# Altium project Multi-Channel Design 1 - Brendan Cook.PrjPCB
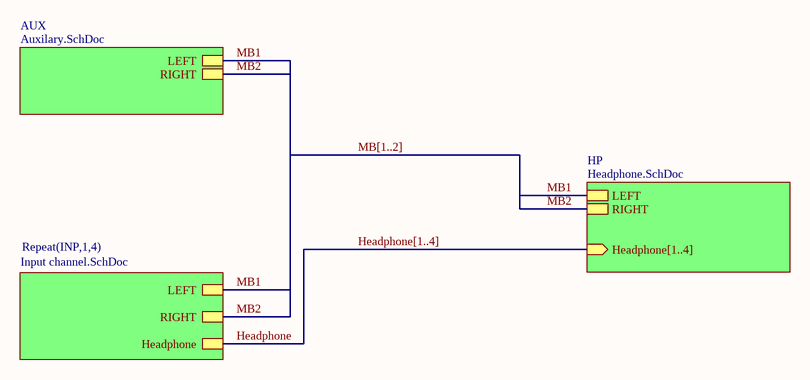
[diagram p0: Mixer.SchDoc]
SCH_REV: A; SCH_ENGINEER_APP_DATE: --/--/----; SCH_ENGINEER: - -----; SCH_DESIGNER_APP_DATE: --/--/----; SCH_DESIGNER: - -----; SCH_CHECKER_APP_DATE: --/--/----; SCH_CHECKER: - -----; Project_Name: ABC123; PCB_TITLE_2: <TITLE 2>; PCB_TITLE_1: <TITLE 1>; PCB_SCALE: NONE; PCB_REV: 1.0; PCB_PART_NUMBER: <PCB PN>; PCB_ENGINEER_APP_DATE: --/--/----; PCB_ENGINEER: - -----; PCB_DWG_NO: A-ET-A365-001; PCB_DESIGNER_APP_DATE: --/--/----; PCB_DESIGNER: - -----; PCB_CHECKER_APP_DATE: --/--/----; PCB_CHECKER: - -----; PCB_ASSEMBLY_NO: <PCB ASSY NO>; PCB_ANG_TOL: +/-1/2; PCB_3_DEC_TOL: +/-.010; PCB_2_DEC_TOL: +/-.01; DRAFTSMAN_FABRICATION_SCALE: 1:1; DRAFTSMAN_ASSEMBLY_SCALE: 1:1; DOC_NO_SCH_DWG: <SCH DWG NO>; DOC_NO_FAB_DWG: <FAB DWG NO>; DOC_NO_BOM: <BOM DOC NO>; DOC_NO_ASSY_DWG: <ASSY DWG NO>; CONTRACT_NUMBER: <CONTRACT NO>; CAGE_CODE: -----; Altium Training Module: Module [--] / [Title]; Altium Training: Altium Designer Advanced Training Course - A365; Altium Department: Altium Training Department
4 sheets, 97 parts. Net scope: hierarchical (ports join the sheet entries above them; power ports are global).
Board file: Mixer.PCBDOC
Sheets:
  Mixer.SchDoc
    AUX = Auxilary.SchDoc
    HP = Headphone.SchDoc
    INP1 = Input channel.SchDoc
    INP2 = Input channel.SchDoc
    INP3 = Input channel.SchDoc
    INP4 = Input channel.SchDoc

## Sheet Mixer.SchDoc
size 431 x 279 mm; Organization: ORGANIZATION; Address1: ADDRESS 1; Address2: ADDRESS 2; Address3: ADDRESS 3; Address4: ADDRESS 4; Revision: -; ENG_APP_DATE: --/--/--; DSN_APP_DATE: --/--/--; CHK_APP_DATE: --/--/--

### Sub-sheets
AUX = Auxilary.SchDoc: LEFT, RIGHT
HP = Headphone.SchDoc: Headphone[1..4] (in), LEFT, RIGHT
Repeat(INP,1,4) = Input channel.SchDoc: LEFT, RIGHT, Headphone

### Nets
MB1: sheet AUX/LEFT, sheet HP/LEFT, sheet Repeat(INP,1,4)/LEFT  [project net LCHANNEL]
MB2: sheet AUX/RIGHT, sheet HP/RIGHT, sheet Repeat(INP,1,4)/RIGHT

### Buses and harness runs
bus Headphone[1..4] = sheet HP/Headphone[1..4]
bus MB[1..2]

### Notes on the sheet
- DWG. NO.
- REV.
- SHT.
- THIS DOCUMENT AND THE DATA DISCLOSED HEREIN OR HEREWITH IS THE PROPERTY OF ALTIUM LIMITED AND MAY BE FREELY DISTRIBUTED IN WHOLE. NO RIGHTS ARE RESERVED OR EXPRESS OR IMPLIED WARANTEE GIVEN.
- REVISION
- DESCRIPTION
- DATE
- APPROVED
- ENG:
- DSN:
- APPROVALS
- PROJECT REVISION:
- www.altium.com <http://www.altium.com>
- DOCUMENT REVISION:
- 92037, La Jolla
- USA
- Altium Ltd.
- 4225 Executive Square
- CHK:
- REFERENCE DOCUMENTS
- DESIGN ITEM:
- TITLE
- VARIANT
- BOM:
- FAB DWG:
- PCB DWG:
- ASSY DWG:
- SCALE:
- SIZE
- B
- CAGE CODE
- FILE NAME
- DWG NO.
- SHEET
- OF
- REV

## Sheet Auxilary.SchDoc: Multi-Channel Design
size 431 x 279 mm; Organization: Altium Limited; Address1: L3, 12a Rodborough Rd; Address2: Frenchs Forest; Address3: NSW; Address4: Australia 2086; DocumentNumber: 1; SheetNumber: 1; SheetTotal: 8
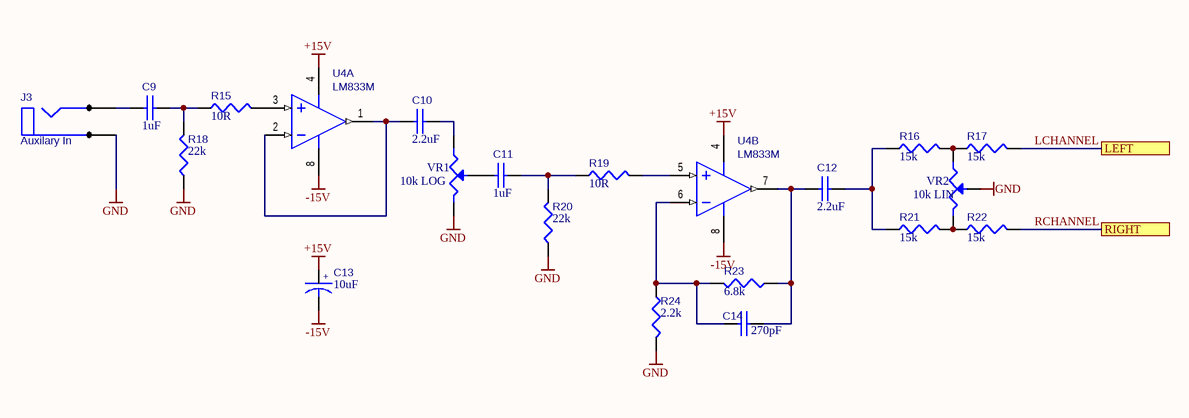
[diagram p1: Auxilary.SchDoc]

### Parts
C9  1uF  [RB.2/.4-NP]
C10  2.2uF  [RB.2/.4-NP]
C11  1uF  [RB.2/.4-NP]
C12  2.2uF  [RB.2/.4-NP]
C13  10uF  [RB.2/.4]
C14  270pF  [RAD0.2]
J3  Auxilary In  [JACK-6.25MM]
R15  10R  [AXIAL0.4]
R16  15k  [AXIAL0.4]
R17  15k  [AXIAL0.4]
R18  22k  [AXIAL0.4]
R19  10R  [AXIAL0.4]
R20  22k  [AXIAL0.4]
R21  15k  [AXIAL0.4]
R22  15k  [AXIAL0.4]
R23  6.8k  [AXIAL0.4]
R24  2.2k  [AXIAL0.4]
U4  LM833M  [DIP8]  (parts A,B of 2)
VR1  10k LOG  [POT - 24MM]
VR2  10k LIN  [POT - 24MM]

### Ports
LEFT, RIGHT

### Nets
+15V: C13.1 U4.4(V-)
-15V: C13.2 U4.8(V+)
GND: J3.3(C) R18.1 R20.1 R24.2 VR1.3 VR2.2(W)
LCHANNEL: R17.2 ; port LEFT
RCHANNEL: R22.2 ; port RIGHT  [project net MB2]
NetC9_1: C9.1 J3.1(A)
NetC9_2: C9.2 R15.1 R18.2
NetC10_1: C10.1 U4.1(OUT1) U4.2(IN1-)
NetC10_2: C10.2 VR1.1
NetC11_1: C11.1 VR1.2(W)
NetC11_2: C11.2 R19.1 R20.2
NetC12_1: C12.1 C14.2 R23.1 U4.7(OUT2)
NetC12_2: C12.2 R16.1 R21.1
NetC14_1: C14.1 R23.2 R24.1 U4.6(IN2-)
NetR15_2: R15.2 U4.3(IN1+)
NetR16_2: R16.2 R17.1 VR2.1
NetR19_2: R19.2 U4.5(IN2+)
NetR21_2: R21.2 R22.1 VR2.3

### Notes on the sheet
- 8
- 7
- 6
- 5
- 4
- 3
- DWG. NO.
- REV.
- SHT.
- 2
- 1
- THIS DOCUMENT AND THE DATA DISCLOSED HEREIN OR HEREWITH IS THE PROPERTY OF ALTIUM LIMITED AND MAY BE FREELY DISTRIBUTED IN WHOLE. NO RIGHTS ARE RESERVED OR EXPRESS OR IMPLIED WARANTEE GIVEN.
- REVISION
- DESCRIPTION
- DATE
- APPROVED
- F
- E
- D
- C
- B
- A
- TITLE
- SCALE:
- SIZE
- CAGE CODE
- FILE NAME
- DWG NO.
- SHEET
- OF
- REV
- (in symbol CAPACITOR POL) +

### Library data of the parts
C9-C12 C14 = CAP: Capacitor
  C14: Value: 270pF
C13 = CAPACITOR POL: Bi-Polar Capacitor; Value: 10uF
J3 = PHONEJACK MONO
R15-R24 = RES1: Resistor
  R15 R19: Value: 10R
  R16 R17 R21 R22: Value: 15k
  R18 R20: Value: 22k
  R23: Value: 6.8k
  R24: Value: 2.2k
U4 = LM833M: Fast Settling Dual Operational Amplifier
VR1 VR2 = POT1: Potentiometer

## Sheet Headphone.SchDoc: Multi-Channel Design
size 431 x 279 mm; Organization: Altium Limited; Address1: L3, 12a Rodborough Rd; Address2: Frenchs Forest; Address3: NSW; Address4: Australia 2086; DocumentNumber: 3; SheetNumber: 3; SheetTotal: 8
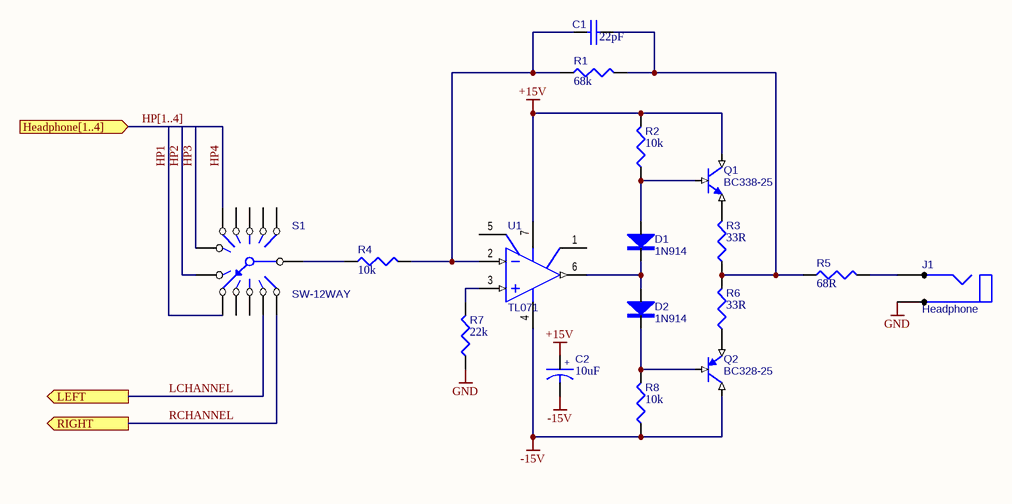
[diagram p2: Headphone.SchDoc]

### Parts
C1  22pF  [RAD0.2]
C2  10uF  [RB.2/.4]
D1  1N914  [DIODE0.4]
D2  1N914  [DIODE0.4]
J1  Headphone  [JACK-6.25MM]
Q1  BC338-25  [TO-92A]
Q2  BC328-25  [TO-92A]
R1  68k  [AXIAL0.4]
R2  10k  [AXIAL0.4]
R3  33R  [AXIAL0.4]
R4  10k  [AXIAL0.4]
R5  68R  [AXIAL0.4]
R6  33R  [AXIAL0.4]
R7  22k  [AXIAL0.4]
R8  10k  [AXIAL0.4]
S1  SW-12WAY  [SW-12WAY]
U1  TL071  [DIP8]

### Ports
Headphone[1..4] (in), LEFT (out), RIGHT (out)

### Nets
+15V: C2.1 Q1.1(C) R2.2 U1.7(VCC+)
-15V: C2.2 Q2.1(C) R8.1 U1.4(VCC-)
GND: J1.3(C) R7.1
HP1: S1.8  [project net Headphone1]
HP2: S1.7  [project net Headphone2]
HP3: S1.6  [project net Headphone3]
HP4: S1.5  [project net Headphone4]
LCHANNEL: S1.11 ; port LEFT
RCHANNEL: S1.12 ; port RIGHT  [project net MB2]
NetC1_1: C1.1 R1.1 R4.2 U1.2(IN-)
NetC1_2: C1.2 R1.2 R3.1 R5.1 R6.2
NetD1_1: D1.1(A) Q1.2(B) R2.1
NetD1_2: D1.2(K) D2.1(A) U1.6(OUT)
NetD2_2: D2.2(K) Q2.2(B) R8.2
NetJ1_1: J1.1(A) R5.2
NetQ1_3: Q1.3(E) R3.2
NetQ2_3: Q2.3(E) R6.1
NetR4_1: R4.1 S1.13
NetR7_2: R7.2 U1.3(IN+)

Not connected (* = marked no-connect by the designer): S1 1 2 3 4 9 10; U1 1(N1/O.S.) 5(O.S._N2)

### Buses and harness runs
bus HP[1..4] = port Headphone[1..4]

### Notes on the sheet
- 8
- 7
- 6
- 5
- 4
- 3
- DWG. NO.
- REV.
- SHT.
- 2
- 1
- THIS DOCUMENT AND THE DATA DISCLOSED HEREIN OR HEREWITH IS THE PROPERTY OF ALTIUM LIMITED AND MAY BE FREELY DISTRIBUTED IN WHOLE. NO RIGHTS ARE RESERVED OR EXPRESS OR IMPLIED WARANTEE GIVEN.
- REVISION
- DESCRIPTION
- DATE
- APPROVED
- F
- E
- D
- C
- B
- A
- TITLE
- SCALE:
- SIZE
- CAGE CODE
- FILE NAME
- DWG NO.
- SHEET
- OF
- REV
- (in symbol CAPACITOR POL) +

### Library data of the parts
C1 = CAP: Capacitor
C2 = CAPACITOR POL: Bi-Polar Capacitor; Value: 10uF
D1 D2 = 1N914: Diode
J1 = PHONEJACK MONO
Q1 = BC338-25: NPN BJT
Q2 = BC328-25: PNP BJT
R1-R8 = RES1: Resistor
  R1: Value: 68k
  R2 R4 R8: Value: 10k
  R3 R6: Value: 33R
  R5: Value: 68R
  R7: Value: 22k
U1 = TL071: Low-Noise  JFET-Input Operational Amplifiers

## Sheet Input channel.SchDoc: Multi-Channel Design
size 431 x 279 mm; Organization: Altium Limited; Address1: L3, 12a Rodborough Rd; Address2: Frenchs Forest; Address3: NSW; Address4: Australia 2086; DocumentNumber: 4; SheetNumber: 4; SheetTotal: 8
Used 4 times, as channels INP1, INP2, INP3, INP4. Parts and nets are listed once, with the designators drawn on the sheet.
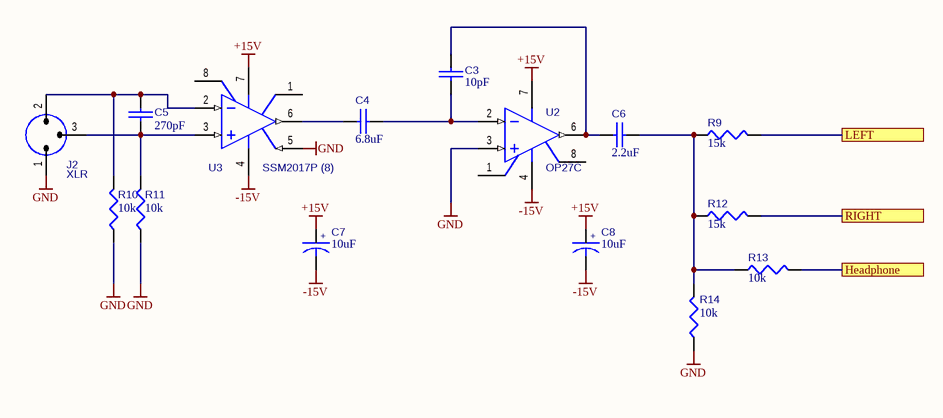
[diagram p3: Input channel.SchDoc]

### Parts
C3  10pF  [RAD0.2]
C4  6.8uF  [RB.2/.4-NP]
C5  270pF  [RAD0.2]
C6  2.2uF  [RB.2/.4-NP]
C7  10uF  [RB.2/.4]
C8  10uF  [RB.2/.4]
J2  XLR  [XLR-FEMALE]
R9  15k  [AXIAL0.4]
R10  10k  [AXIAL0.4]
R11  10k  [AXIAL0.4]
R12  15k  [AXIAL0.4]
R13  10k  [AXIAL0.4]
R14  10k  [AXIAL0.4]
U2  OP27C  [DIP8]
U3  SSM2017P (8)  [DIP8]

### Ports
Headphone, LEFT, RIGHT

### Nets
+15V: C7.1 C8.1 U2.7(V+) U3.7(V+)
-15V: C7.2 C8.2 U2.4(V-) U3.4(V-)
GND: J2.1 R10.1 R11.1 R14.1 U2.3(+IN) U3.5(REF)
Headphone: R13.2 ; port Headphone
LEFT: R9.2 ; port LEFT
RIGHT: R12.2 ; port RIGHT
NetC3_1: C3.1 C4.2 U2.2(-IN)
NetC3_2: C3.2 C6.1 U2.6(OUT)
NetC4_1: C4.1 U3.6(OUT)
NetC5_1: C5.1 J2.2 R10.2 U3.2(IN-)
NetC5_2: C5.2 J2.3 R11.2 U3.3(IN+)
NetC6_2: C6.2 R9.1 R12.1 R13.1 R14.2

Not connected (* = marked no-connect by the designer): U2 1(TRIM) 8(TRIM); U3 1(RG1) 8(RG2)

### Channels
INP1: designators C3=INP1_C3 C4=INP1_C4 C5=INP1_C5 C6=INP1_C6 C7=INP1_C7 C8=INP1_C8 J2=INP1_J2 R9=INP1_R9 R10=INP1_R10 R11=INP1_R11 R12=INP1_R12 R13=INP1_R13 R14=INP1_R14 U2=INP1_U2 U3=INP1_U3; ports Headphone=Headphone LEFT=LCHANNEL RIGHT=MB2
INP2: designators C3=INP2_C3 C4=INP2_C4 C5=INP2_C5 C6=INP2_C6 C7=INP2_C7 C8=INP2_C8 J2=INP2_J2 R9=INP2_R9 R10=INP2_R10 R11=INP2_R11 R12=INP2_R12 R13=INP2_R13 R14=INP2_R14 U2=INP2_U2 U3=INP2_U3; ports Headphone=Headphone LEFT=LCHANNEL RIGHT=MB2
INP3: designators C3=INP3_C3 C4=INP3_C4 C5=INP3_C5 C6=INP3_C6 C7=INP3_C7 C8=INP3_C8 J2=INP3_J2 R9=INP3_R9 R10=INP3_R10 R11=INP3_R11 R12=INP3_R12 R13=INP3_R13 R14=INP3_R14 U2=INP3_U2 U3=INP3_U3; ports Headphone=Headphone LEFT=LCHANNEL RIGHT=MB2
INP4: designators C3=INP4_C3 C4=INP4_C4 C5=INP4_C5 C6=INP4_C6 C7=INP4_C7 C8=INP4_C8 J2=INP4_J2 R9=INP4_R9 R10=INP4_R10 R11=INP4_R11 R12=INP4_R12 R13=INP4_R13 R14=INP4_R14 U2=INP4_U2 U3=INP4_U3; ports Headphone=Headphone LEFT=LCHANNEL RIGHT=MB2

### Notes on the sheet
- 8
- 7
- 6
- 5
- 4
- 3
- DWG. NO.
- REV.
- SHT.
- 2
- 1
- THIS DOCUMENT AND THE DATA DISCLOSED HEREIN OR HEREWITH IS THE PROPERTY OF ALTIUM LIMITED AND MAY BE FREELY DISTRIBUTED IN WHOLE. NO RIGHTS ARE RESERVED OR EXPRESS OR IMPLIED WARANTEE GIVEN.
- REVISION
- DESCRIPTION
- DATE
- APPROVED
- F
- E
- D
- C
- B
- A
- TITLE
- SCALE:
- SIZE
- CAGE CODE
- FILE NAME
- DWG NO.
- SHEET
- OF
- REV
- (in symbol CAPACITOR POL) +

### Library data of the parts
C3-C6 = CAP: Capacitor
C7 C8 = CAPACITOR POL: Bi-Polar Capacitor; Value: 10uF
J2 = XLR: XLR connector, PCB mounted
R9-R14 = RES1: Resistor
  R9 R12: Value: 15k
  R10 R11 R13 R14: Value: 10k
U2 = OP27C: Low Noise, High Speed Precision Operational Amplifier
U3 = SSM2017P (8): Self-Contained Audio Preamplifier

## Nets that join several sheets
+15V: Auxilary (C13.1 U4.4), Headphone (C2.1 Q1.1 R2.2 U1.7), INP1 (INP1_C7.1 INP1_C8.1 INP1_U2.7 INP1_U3.7), INP2 (INP2_C7.1 INP2_C8.1 INP2_U2.7 INP2_U3.7), INP3 (INP3_C7.1 INP3_C8.1 INP3_U2.7 INP3_U3.7), INP4 (INP4_C7.1 INP4_C8.1 INP4_U2.7 INP4_U3.7)
-15V: Auxilary (C13.2 U4.8), Headphone (C2.2 Q2.1 R8.1 U1.4), INP1 (INP1_C7.2 INP1_C8.2 INP1_U2.4 INP1_U3.4), INP2 (INP2_C7.2 INP2_C8.2 INP2_U2.4 INP2_U3.4), INP3 (INP3_C7.2 INP3_C8.2 INP3_U2.4 INP3_U3.4), INP4 (INP4_C7.2 INP4_C8.2 INP4_U2.4 INP4_U3.4)
GND: Auxilary (6 pins), Headphone (J1.3 R7.1), INP1 (6 pins), INP2 (6 pins), INP3 (6 pins), INP4 (6 pins)
Headphone: INP1 (INP1_R13.2), INP2 (INP2_R13.2), INP3 (INP3_R13.2), INP4 (INP4_R13.2)
LCHANNEL: Auxilary (R17.2), Headphone (S1.11), INP1 (INP1_R9.2), INP2 (INP2_R9.2), INP3 (INP3_R9.2), INP4 (INP4_R9.2)
MB2: Auxilary (R22.2), Headphone (S1.12), INP1 (INP1_R12.2), INP2 (INP2_R12.2), INP3 (INP3_R12.2), INP4 (INP4_R12.2)